# Altium project ACTUALFINALECU.PrjPcb (part 1 of 2)
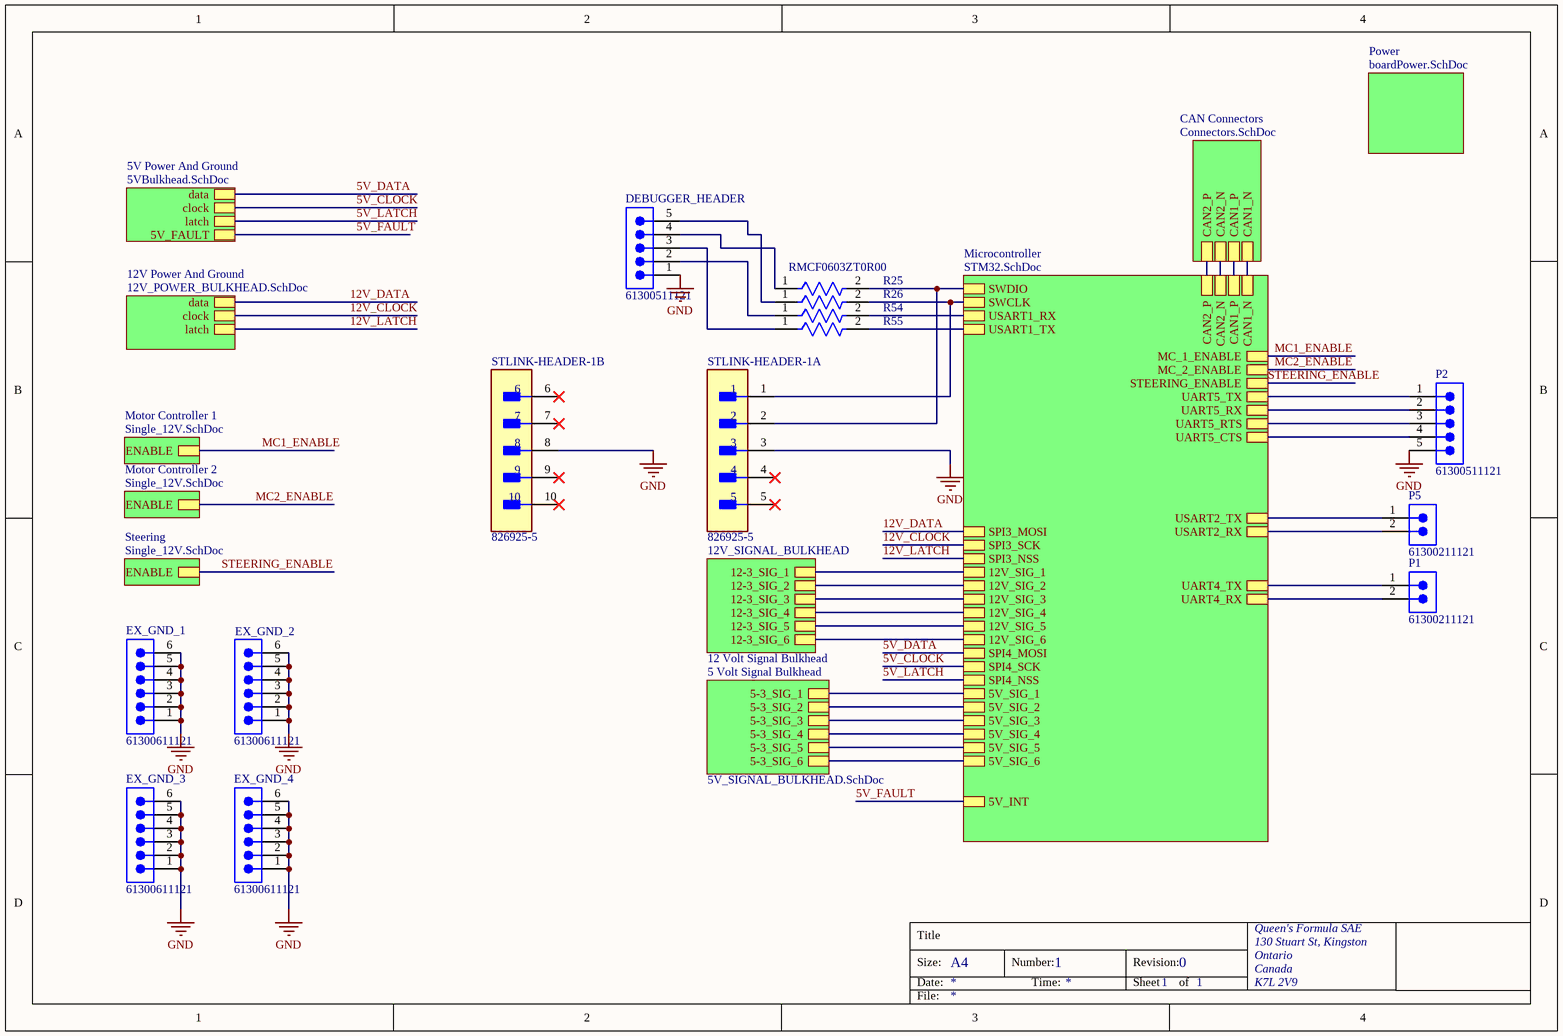
[diagram p0: TOP.SchDoc]
16 sheets, 240 parts. Net scope: hierarchical (ports join the sheet entries above them; power ports are global).
Board file: PCB.PcbDoc
Sheets:
  TOP.SchDoc
    Microcontroller = STM32.SchDoc
      CAN1 = CAN.SchDoc
      CAN2 = CAN.SchDoc
    12V Power And Ground = 12V_POWER_BULKHEAD.SchDoc
      Shift Register = shiftRegister.SchDoc
      Designator = 12V_LS.SchDoc
      Designator = 12V_LS.SchDoc
      Designator = 12V_LS.SchDoc
      Designator = 12V_LS.SchDoc
      Designator = 12V_LS.SchDoc
      Designator = 12V_LS.SchDoc
    Power = boardPower.SchDoc
      Buck = Buck.SchDoc
      LDO = LDO.SchDoc
    CAN Connectors = Connectors.SchDoc
    12 Volt Signal Bulkhead = 12V_SIGNAL_BULKHEAD.SchDoc
       = 12_TO_3V3_VOLTAGE_DIVIDER.SchDoc
       = 12_TO_3V3_VOLTAGE_DIVIDER.SchDoc
       = 12_TO_3V3_VOLTAGE_DIVIDER.SchDoc
       = 12_TO_3V3_VOLTAGE_DIVIDER.SchDoc
       = 12_TO_3V3_VOLTAGE_DIVIDER.SchDoc
       = 12_TO_3V3_VOLTAGE_DIVIDER.SchDoc
    5V Power And Ground = 5VBulkhead.SchDoc
      Shift Register = shiftRegister.SchDoc
      5VLS1 = 5V_LS.SchDoc
      5VLS2 = 5V_LS.SchDoc
      5VLS3 = 5V_LS.SchDoc
      5VLS4 = 5V_LS.SchDoc
      5VLS5 = 5V_LS.SchDoc
      5VLS6 = 5V_LS.SchDoc
    5 Volt Signal Bulkhead = 5V_SIGNAL_BULKHEAD.SchDoc
    Motor Controller 1 = Single_12V.SchDoc
      Designator = 12V_LS.SchDoc
    Motor Controller 2 = Single_12V.SchDoc
      Designator = 12V_LS.SchDoc
    Steering = Single_12V.SchDoc
      Designator = 12V_LS.SchDoc

## Sheet TOP.SchDoc: =DocumentName
size A4; Organization: Queen's Formula SAE; Address1: 130 Stuart St, Kingston; Address2: Ontario; Address3: Canada; Address4: K7L 2V9; DocumentNumber: 1; Revision: 0; SheetNumber: 1; SheetTotal: 1

### Parts
DEBUGGER_HEADER  61300511121  [61300511121]
EX_GND_1  61300611121  [61300611121]
EX_GND_2  61300611121  [61300611121]
EX_GND_3  61300611121  [61300611121]
EX_GND_4  61300611121  [61300611121]
P1  61300211121  [61300211121]
P2  61300511121  [61300511121]
P5  61300211121  [61300211121]
R25  RMCF0603ZT0R00  [FP-RMCF0603-MFG]
R26  RMCF0603ZT0R00  [FP-RMCF0603-MFG]  (value not drawn)
R54  RMCF0603ZT0R00  [FP-RMCF0603-MFG]  (value not drawn)
R55  RMCF0603ZT0R00  [FP-RMCF0603-MFG]  (value not drawn)
STLINK-HEADER-1  826925-5  [FP-826925-5-MFG]  (parts A,B of 2)

### Sub-sheets
5 Volt Signal Bulkhead = 5V_SIGNAL_BULKHEAD.SchDoc: 5-3_SIG_1, 5-3_SIG_2, 5-3_SIG_3, 5-3_SIG_4, 5-3_SIG_5, 5-3_SIG_6
5V Power And Ground = 5VBulkhead.SchDoc: data, clock, latch, 5V_FAULT
12 Volt Signal Bulkhead = 12V_SIGNAL_BULKHEAD: 12-3_SIG_1, 12-3_SIG_2, 12-3_SIG_3, 12-3_SIG_4, 12-3_SIG_5, 12-3_SIG_6
12V Power And Ground = 12V_POWER_BULKHEAD.SchDoc: data, clock, latch
CAN Connectors = Connectors.SchDoc: CAN1_N, CAN1_P, CAN2_N, CAN2_P
Microcontroller = STM32.SchDoc: SWDIO, SWCLK, USART1_RX, USART1_TX, SPI3_NSS, SPI3_MOSI, SPI3_SCK, CAN1_P, CAN1_N, CAN2_N, CAN2_P, 12V_SIG_1, MC_1_ENABLE, MC_2_ENABLE, STEERING_ENABLE, 12V_SIG_2, 12V_SIG_4, 12V_SIG_3, 12V_SIG_5, 12V_SIG_6, SPI4_NSS, SPI4_MOSI, SPI4_SCK, 5V_SIG_1, 5V_SIG_2, 5V_SIG_3, 5V_SIG_5, 5V_SIG_4, 5V_SIG_6, UART5_TX, UART5_RX, UART5_RTS, UART5_CTS, 5V_INT, USART2_TX, USART2_RX, UART4_TX, UART4_RX
Motor Controller 1 = Single_12V.SchDoc: ENABLE
Motor Controller 2 = Single_12V.SchDoc: ENABLE
Power = boardPower.SchDoc: no entries
Steering = Single_12V.SchDoc: ENABLE

### Nets
GND: DEBUGGER_HEADER.1 EX_GND_1.1 EX_GND_1.2 EX_GND_1.3 EX_GND_1.4 EX_GND_1.5 EX_GND_1.6 EX_GND_2.1 EX_GND_2.2 EX_GND_2.3 EX_GND_2.4 EX_GND_2.5 EX_GND_2.6 EX_GND_3.1 EX_GND_3.2 EX_GND_3.3 EX_GND_3.4 EX_GND_3.5 EX_GND_3.6 EX_GND_4.1 EX_GND_4.2 EX_GND_4.3 EX_GND_4.4 EX_GND_4.5 EX_GND_4.6 P2.5 STLINK-HEADER-1.3 STLINK-HEADER-1.8
5-3_1: sheet Microcontroller/5V_SIG_1, sheet 5 Volt Signal Bulkhead/5-3_SIG_1
5-3_2: sheet Microcontroller/5V_SIG_2, sheet 5 Volt Signal Bulkhead/5-3_SIG_2
5-3_3: sheet Microcontroller/5V_SIG_3, sheet 5 Volt Signal Bulkhead/5-3_SIG_3
5-3_4: sheet Microcontroller/5V_SIG_4, sheet 5 Volt Signal Bulkhead/5-3_SIG_4
5-3_5: sheet Microcontroller/5V_SIG_5, sheet 5 Volt Signal Bulkhead/5-3_SIG_5
5-3_6: sheet Microcontroller/5V_SIG_6, sheet 5 Volt Signal Bulkhead/5-3_SIG_6
5V_CLOCK: sheet Microcontroller/SPI4_SCK, sheet 5V Power And Ground/clock
5V_DATA: sheet Microcontroller/SPI4_MOSI, sheet 5V Power And Ground/data
5V_FAULT: sheet Microcontroller/5V_INT, sheet 5V Power And Ground/5V_FAULT
5V_LATCH: sheet Microcontroller/SPI4_NSS, sheet 5V Power And Ground/latch
12-3_1: sheet Microcontroller/12V_SIG_1, sheet 12 Volt Signal Bulkhead/12-3_SIG_1
12-3_2: sheet Microcontroller/12V_SIG_2, sheet 12 Volt Signal Bulkhead/12-3_SIG_2
12-3_3: sheet Microcontroller/12V_SIG_3, sheet 12 Volt Signal Bulkhead/12-3_SIG_3
12-3_4: sheet Microcontroller/12V_SIG_4, sheet 12 Volt Signal Bulkhead/12-3_SIG_4
12-3_5: sheet Microcontroller/12V_SIG_5, sheet 12 Volt Signal Bulkhead/12-3_SIG_5
12-3_6: sheet Microcontroller/12V_SIG_6, sheet 12 Volt Signal Bulkhead/12-3_SIG_6
12V_CLOCK: sheet Microcontroller/SPI3_SCK, sheet 12V Power And Ground/clock
12V_DATA: sheet Microcontroller/SPI3_MOSI, sheet 12V Power And Ground/data
12V_LATCH: sheet Microcontroller/SPI3_NSS, sheet 12V Power And Ground/latch
CAN1_N: sheet Microcontroller/CAN1_N, sheet CAN Connectors/CAN1_N
CAN1_P: sheet Microcontroller/CAN1_P, sheet CAN Connectors/CAN1_P
CAN2_N: sheet Microcontroller/CAN2_N, sheet CAN Connectors/CAN2_N
CAN2_P: sheet Microcontroller/CAN2_P, sheet CAN Connectors/CAN2_P
MC1_ENABLE: sheet Microcontroller/MC_1_ENABLE, sheet Motor Controller 1/ENABLE
MC2_ENABLE: sheet Microcontroller/MC_2_ENABLE, sheet Motor Controller 2/ENABLE
STEERING_ENABLE: sheet Microcontroller/STEERING_ENABLE, sheet Steering/ENABLE
NetDEBUGGER_HEADER_2: DEBUGGER_HEADER.2 R54.1
NetDEBUGGER_HEADER_3: DEBUGGER_HEADER.3 R55.1
NetDEBUGGER_HEADER_4: DEBUGGER_HEADER.4 R25.1
NetDEBUGGER_HEADER_5: DEBUGGER_HEADER.5 R26.1
NetP1_1: P1.1 ; sheet Microcontroller/UART4_TX
NetP1_2: P1.2 ; sheet Microcontroller/UART4_RX
NetP2_1: P2.1 ; sheet Microcontroller/UART5_TX
NetP2_2: P2.2 ; sheet Microcontroller/UART5_RX
NetP2_3: P2.3 ; sheet Microcontroller/UART5_RTS
NetP2_4: P2.4 ; sheet Microcontroller/UART5_CTS
NetP5_1: P5.1 ; sheet Microcontroller/USART2_TX
NetP5_2: P5.2 ; sheet Microcontroller/USART2_RX
NetR25_2: R25.2 STLINK-HEADER-1.2 ; sheet Microcontroller/SWDIO
NetR26_2: R26.2 STLINK-HEADER-1.1 ; sheet Microcontroller/SWCLK
NetR54_2: R54.2 ; sheet Microcontroller/USART1_RX
NetR55_2: R55.2 ; sheet Microcontroller/USART1_TX

Not connected (* = marked no-connect by the designer): STLINK-HEADER-1 4* 5* 6* 7* 9* 10*

### Notes on the sheet
- Title
- Size:
- Date:
- A4
- Number:
- Time:
- Revision:
- Sheet
- of
- File:

### Library data of the parts
DEBUGGER_HEADER P2 = CMP-1502-01068-2: NexarPartId: 32855526; Operating Supply Voltage: 250V; Number of Contacts: 5; Connector Type: Male Pin; Current Rating: 3A; Contact Resistance: 20mΩ; Pitch: 2.54mm; Gender: Male; Termination: Solder; RoHS: Compliant; Lead Pitch: 2.54mm; Contact Mating Length: 5.9944mm; Number of Positions: 5; Lead Free: Lead Free; Contact Plating: Gold; Number of Pins: 5; Min Operating Temperature: -40°C; Voltage Rating: 250V; Color: Black; Mount: Through Hole; REACH SVHC: Unknown; Packaging: Bulk; Height: 8.89mm; Number of Rows: 1; Orientation: Vertical; Contact Material: Copper; Max Operating Temperature: 105°C
EX_GND_1-EX_GND_4 = CMP-1502-01070-2: NexarPartId: 20084590; Operating Supply Voltage: 250V; Current Rating: 3A; Number of Contacts: 6; Gender: Male; Connector Type: Male Pin; Pitch: 2.54mm; Contact Resistance: 20mΩ; Lead Free: Lead Free; REACH SVHC: Unknown; Number of Rows: 1; Color: Black; Min Operating Temperature: -40°C; Contact Material: Copper; Lead Pitch: 2.54mm; Contact Plating: Gold; Number of Pins: 6; Height: 8.89mm; Orientation: Vertical; Termination: Through Hole; Mount: Through Hole; RoHS: Compliant; Contact Gender: Male; Contact Mating Length: 5.9944mm; Voltage Rating: 250V; Number of Positions: 6; Housing Material: PBT; Packaging: Bulk; Max Operating Temperature: 105°C
P1 P5 = CMP-1712-00002-5: NexarPartId: 20081794; Operating Supply Voltage: 250V; Current Rating: 3A; Gender: Male; Number of Contacts: 2; Pitch: 2.54mm; Connector Type: Male Pin; Contact Resistance: 20mΩ; Contact Plating: Gold; Contact Material: Copper; Number of Pins: 2; Min Operating Temperature: -40°C; Packaging: Bulk; Lead Pitch: 2.54mm; Mount: Through Hole; Orientation: Vertical; RoHS: Compliant; REACH SVHC: No SVHC; Height: 8.94mm; Termination: Through Hole; Number of Positions: 2; Contact Mating Length: 5.9944mm; Color: Black; Contact Gender: Male; Number of Rows: 1; Housing Material: PBT; Lead Free: Lead Free; Voltage Rating: 250V; Max Operating Temperature: 125°C
R25 R26 R54 R55 = CMP-26527-000011-1: RES 0 OHM JUMPER 1/10W 0603; Manufacturer: Stackpole; Power Rating: 0.1W; Voltage Rating: 75V; Resistance: 0mΩ; Automotive Grade: Grade 0; Value: 0mΩ; Series: RMCF; Manufacturer Part Number: RMCF0603ZT0R00; Device Class L1: Passive Components; Device Class L3: Chip SMD Resistors; Octopart: https://octopart.com/rmcf0603zt0r00-stackpole+electronics-19213618; Temperature: -55°C to +155°C; Lead Free: Yes; ComponentLink2URL: https://www.seielect.com/catalog/sei-rmcf_rmcp.pdf; Height: 0.55mm; Composition: Thick Film; Package: RMCF0603; Automotive: Yes; Temperature Range High: +155°C; Ipc Land Pattern Name: RESC15580X45; Digikey Description: RES 0 OHM JUMPER 1/10W 0603; RoHS: TRUE; ComponentLink2Description: Datasheet; Temperature Range Low: -55°C; Category: Res; Device Class L2: Resistors
STLINK-HEADER-1 = CMP-03369-000006-1: CONN HEADER VERT 10POS 2.54MM; Manufacturer: TE Connectivity; Conn Orientation: Vertical; Standoff Height: 0.3mm; Number Of Contacts: 10; Current Rating: 5A; Conn Gender: Male; Number Of Rows: 2; Category: Conn; Octopart: https://octopart.com/826925-5-te+connectivity-41836231; Lead Free: Yes; Height: 9.9mm; ComponentLink2Description: Datasheet; Temperature Range High: +105°C; Pitch: 2.54mm; Manufacturer Part Number: 826925-5; Automotive: No; Digikey Description: CONN HEADER VERT 10POS 2.54MM; ComponentLink2URL: https://www.te.com/commerce/DocumentDelivery/DDEController?Action=showdoc&DocId=Customer+Drawing%7F826629%7FAC%7Fpdf%7FEnglish%7FENG_CD_826629_AC.pdf%7F826925-5; Temperature: -65°C to +105°C; RoHS: TRUE; Package: 826925-5; Contact Material: Tin,Nickel; Mouser Description: Headers & Wire Housings 2X05 POS VERT TIN; Device Class L2: Headers and Wire Housings; Device Class L3: unset; Device Class L1: Connectors; Temperature Range Low: -65°C

## Sheet STM32.SchDoc
size A4
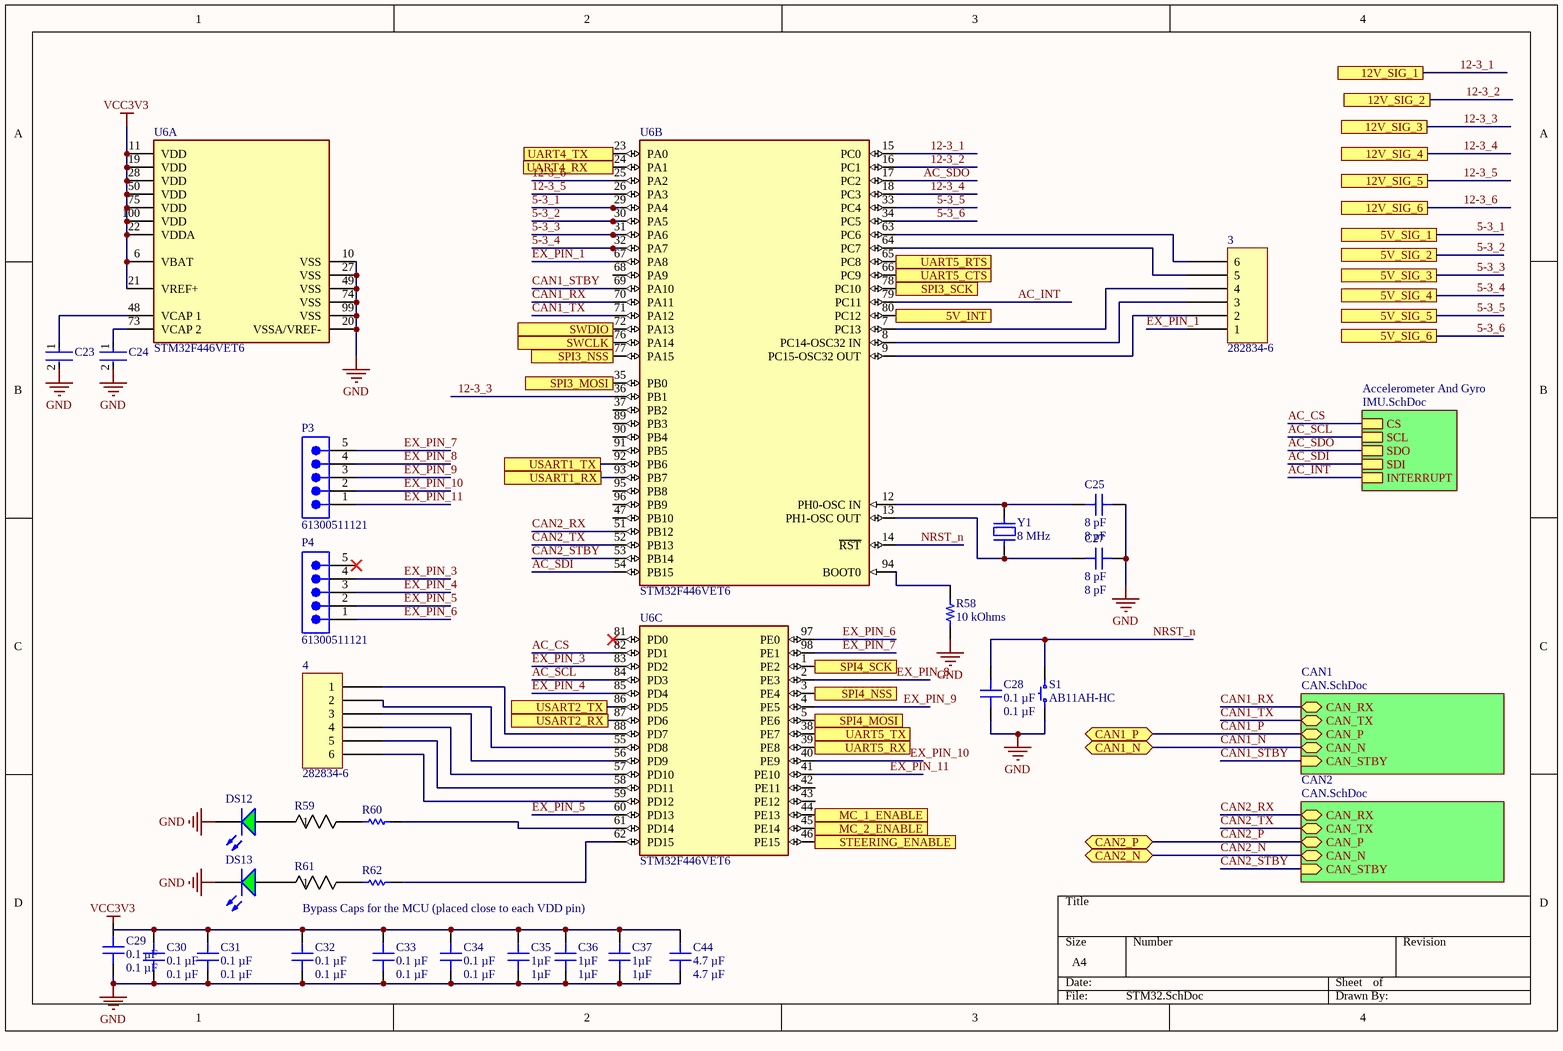
[diagram p1: STM32.SchDoc]

### Parts
3  282834-6  [TE 282834-6]
4  282834-6  [TE 282834-6]
C23  GRM188R71A225KE15D  [FP-GRM188-0_1-e0_2_0_5-MFG]  (value not drawn)
C24  GRM188R71A225KE15D  [FP-GRM188-0_1-e0_2_0_5-MFG]  (value not drawn)
C25  8 pF  [CAP 0805_2012]
C27  8 pF  [CAP 0805_2012]
C28  0.1 µF  [CAP 0805_2012]
C29  0.1 µF  [CAP 0805_2012]
C30  0.1 µF  [CAP 0805_2012]
C31  0.1 µF  [CAP 0805_2012]
C32  0.1 µF  [CAP 0805_2012]
C33  0.1 µF  [CAP 0805_2012]
C34  0.1 µF  [CAP 0805_2012]
C35  1µF  [CAP 0805_2012]
C36  1µF  [CAP 0805_2012]
C37  1µF  [CAP 0805_2012]
C44  4.7 µF  [CAP 0805_2012]
DS12  HLMP-4740  [AVAG-HLMP-4740]  (value not drawn)
DS13  HLMP-4740  [AVAG-HLMP-4740]  (value not drawn)
P3  61300511121  [61300511121]
P4  61300511121  [61300511121]
R58  10 kOhms  [RES 0805_2012]
R59  AC01000005000JA100  [RES_AC01_VIS]  (value not drawn)
R60  RC0805FR-071KL  [RESC2013X60X35ML10T20]  (value not drawn)
R61  AC01000005000JA100  [RES_AC01_VIS]  (value not drawn)
R62  RC0805FR-071KL  [RESC2013X60X35ML10T20]  (value not drawn)
S1  AB11AH-HC  [NKK AB11AH-HC]
U6  STM32F446VET6  [FP-LQFP100-1L-MFG]  (parts A,B,C of 3)
Y1  8 MHz  [ABRACON ABLS]

### Sub-sheets
Accelerometer And Gyro = IMU.SchDoc (file not in this document): CS, SCL, SDO, SDI, INTERRUPT
CAN1 = CAN.SchDoc: CAN_RX (bidir), CAN_TX (bidir), CAN_STBY (in), CAN_P (bidir), CAN_N (bidir)
CAN2 = CAN.SchDoc: CAN_RX (bidir), CAN_TX (bidir), CAN_STBY (in), CAN_P (bidir), CAN_N (bidir)

### Ports
5V_INT, 5V_SIG_1, 5V_SIG_2, 5V_SIG_3, 5V_SIG_4, 5V_SIG_5, 5V_SIG_6, 12V_SIG_1, 12V_SIG_2, 12V_SIG_3, 12V_SIG_4, 12V_SIG_5, 12V_SIG_6, CAN1_N (bidir), CAN1_P (bidir), CAN2_N (bidir), CAN2_P (bidir), MC_1_ENABLE, MC_2_ENABLE, SPI3_MOSI, SPI3_NSS, SPI3_SCK, SPI4_MOSI, SPI4_NSS, SPI4_SCK, STEERING_ENABLE, SWCLK, SWDIO, UART4_RX, UART4_TX, UART5_CTS, UART5_RTS, UART5_RX, UART5_TX, USART1_RX, USART1_TX, USART2_RX, USART2_TX

### Nets
GND: C23.2 C24.2 C25.2 C27.2 C28.1 C29.1 C30.1 C31.1 C32.1 C33.1 C34.1 C35.1 C36.1 C37.1 C44.1 DS12.2(K) DS13.2(K) R58.1 S1.1 U6.10(VSS) U6.20(VSSA/VREF-) U6.27(VSS) U6.49(VSS) U6.74(VSS) U6.99(VSS)
VCC3V3: C30.2 C31.2 C32.2 C33.2 C34.2 C35.2 C36.2 C37.2 C44.2 U6.6(VBAT) U6.11(VDD) U6.19(VDD) U6.21(VREF+) U6.22(VDDA) U6.28(VDD) U6.50(VDD) U6.75(VDD) U6.100(VDD)
5-3_1: U6.29(PA4) ; port 5V_SIG_1
5-3_2: U6.30(PA5) ; port 5V_SIG_2
5-3_3: U6.31(PA6) ; port 5V_SIG_3
5-3_4: U6.32(PA7) ; port 5V_SIG_4
5-3_5: U6.33(PC4) ; port 5V_SIG_5
5-3_6: U6.34(PC5) ; port 5V_SIG_6
5V_CLOCK: U6.1(PE2) ; port SPI4_SCK
5V_DATA: U6.5(PE6) ; port SPI4_MOSI
5V_FAULT: U6.80(PC12) ; port 5V_INT
5V_LATCH: U6.3(PE4) ; port SPI4_NSS
12-3_1: U6.15(PC0) ; port 12V_SIG_1
12-3_2: U6.16(PC1) ; port 12V_SIG_2
12-3_3: U6.36(PB1) ; port 12V_SIG_3
12-3_4: U6.18(PC3) ; port 12V_SIG_4
12-3_5: U6.26(PA3) ; port 12V_SIG_5
12-3_6: U6.25(PA2) ; port 12V_SIG_6
12V_CLOCK: U6.78(PC10) ; port SPI3_SCK
12V_DATA: U6.35(PB0) ; port SPI3_MOSI
12V_LATCH: U6.77(PA15) ; port SPI3_NSS
AC_CS: U6.82(PD1) ; sheet Accelerometer And Gyro/CS
AC_INT: U6.79(PC11) ; sheet Accelerometer And Gyro/INTERRUPT
AC_SCL: U6.84(PD3) ; sheet Accelerometer And Gyro/SCL
AC_SDI: U6.54(PB15) ; sheet Accelerometer And Gyro/SDI
AC_SDO: U6.17(PC2) ; sheet Accelerometer And Gyro/SDO
CAN1_N: port CAN1_N, sheet CAN1/CAN_N
CAN1_P: port CAN1_P, sheet CAN1/CAN_P
CAN1_RX: U6.70(PA11) ; sheet CAN1/CAN_RX
CAN1_STBY: U6.69(PA10) ; sheet CAN1/CAN_STBY
CAN1_TX: U6.71(PA12) ; sheet CAN1/CAN_TX
CAN2_N: port CAN2_N, sheet CAN2/CAN_N
CAN2_P: port CAN2_P, sheet CAN2/CAN_P
CAN2_RX: U6.51(PB12) ; sheet CAN2/CAN_RX
CAN2_STBY: U6.53(PB14) ; sheet CAN2/CAN_STBY
CAN2_TX: U6.52(PB13) ; sheet CAN2/CAN_TX
EX_PIN_1: 3.1 U6.67(PA8)
EX_PIN_3: P4.4 U6.83(PD2)
EX_PIN_4: P4.3 U6.85(PD4)
EX_PIN_5: P4.2 U6.60(PD13)
EX_PIN_6: P4.1 U6.97(PE0)
EX_PIN_7: P3.5 U6.98(PE1)
EX_PIN_8: P3.4 U6.2(PE3)
EX_PIN_9: P3.3 U6.4(PE5)
EX_PIN_10: P3.2 U6.40(PE9)
EX_PIN_11: P3.1 U6.41(PE10)
MC1_ENABLE: U6.44(PE13) ; port MC_1_ENABLE
MC2_ENABLE: U6.45(PE14) ; port MC_2_ENABLE
NRST_n: C28.2 S1.2 U6.14(~{RST})
STEERING_ENABLE: U6.46(PE15) ; port STEERING_ENABLE
Net3_2: 3.2 U6.9(PC15-OSC32_OUT)
Net3_3: 3.3 U6.8(PC14-OSC32_IN)
Net3_4: 3.4 U6.7(PC13)
Net3_5: 3.5 U6.64(PC7)
Net3_6: 3.6 U6.63(PC6)
Net4_1: 4.1 U6.88(PD7)
Net4_2: 4.2 U6.55(PD8)
Net4_3: 4.3 U6.56(PD9)
Net4_4: 4.4 U6.57(PD10)
Net4_5: 4.5 U6.58(PD11)
Net4_6: 4.6 U6.59(PD12)
NetC23_1: C23.1 U6.48(VCAP_1)
NetC24_1: C24.1 U6.73(VCAP_2)
NetC25_1: C25.1 U6.12(PH0-OSC_IN) Y1.2
NetC27_1: C27.1 U6.13(PH1-OSC_OUT) Y1.1
NetDS12_1: DS12.1(A) R59.1
NetDS13_1: DS13.1(A) R61.1
NetP1_1: U6.23(PA0) ; port UART4_TX
NetP1_2: U6.24(PA1) ; port UART4_RX
NetP2_1: U6.38(PE7) ; port UART5_TX
NetP2_2: U6.39(PE8) ; port UART5_RX
NetP2_3: U6.65(PC8) ; port UART5_RTS
NetP2_4: U6.66(PC9) ; port UART5_CTS
NetP5_1: U6.86(PD5) ; port USART2_TX
NetP5_2: U6.87(PD6) ; port USART2_RX
NetR25_2: U6.72(PA13) ; port SWDIO
NetR26_2: U6.76(PA14) ; port SWCLK
NetR54_2: U6.93(PB7) ; port USART1_RX
NetR55_2: U6.92(PB6) ; port USART1_TX
NetR58_2: R58.2 U6.94(BOOT0)
NetR59_2: R59.2 R60.1
NetR60_2: R60.2 U6.61(PD14)
NetR61_2: R61.2 R62.1
NetR62_2: R62.2 U6.62(PD15)

Not connected (* = marked no-connect by the designer): C29 2; P4 5*; U6 37(PB2) 42(PE11) 43(PE12) 47(PB10) 68(PA9) 81(PD0)* 89(PB3) 90(PB4) 91(PB5) 95(PB8) 96(PB9)

### Notes on the sheet
- Bypass Caps for the MCU (placed close to each VDD pin)

### Library data of the parts
3 4 = 282834-6: TERM BLK 6P SIDE ENT 2.54MM PCB; Manufacturer: TE Connectivity AMP Connectors; Current: 10A; Mating Orientation: Horizontal with Board; Number of Levels: 1; Pitch: 0.100" (2.54mm); Positions Per Level: 6; Voltage: 150V; Wire Gauge: 16-30 AWG; Wire Termination: Screw - Rising Cage Clamp; Part Number: 282834-6; Color: Green; ComponentLink1Description: Datasheet; ComponentLink1URL: https://www.te.com/commerce/DocumentDelivery/DDEController?Action=srchrtrv&DocNm=282834&DocType=Customer+Drawing&DocLang=English; ComponentLink2Description: DigiKey Link; ComponentLink2URL: http://digikey.com/product-detail/en/te-connectivity-amp-connectors/282834-6/A98337-ND/1153267; LastUpdated: 2020-01-15 4:16:31 AM; Lifecycle Status: Active; Minimum Order: 1; Mounting Type: Through Hole; Packaging: Bulk; Part Status: Active; Price: 4.72; Series: Buchanan; Supplier 1: DigiKey; Supplier Part Number 1: A98337-ND
C23 C24 = CMP-2006-02836-2: Chip Multilayer Ceramic Capacitors for General Purpose, 0603, 2.2uF, X7R, 15%, 10%, 10V; Case Code (Metric): 1608; Height: 0.8mm; Packaging: Cut Tape; Voltage: 10V; Lead Free: Lead Free; Min Operating Temperature: -55°C; Voltage Rating (DC): 10V; Max Operating Temperature: 125°C; Voltage Rating: 10V; Dielectric: X7R; Depth: 0.8mm; Case Code (Imperial): 0603; Termination: SMD/SMT; Case/Package: 0603; Number of Pins: 2; REACH SVHC: No SVHC; Mount: Surface Mount; Width: 0.031inch; Material: Ceramic; Capacitance: 2.2uF; Package Quantity: 1; Weight: 7.1E-05oz; Length: 1.6mm; Thickness: 0.035inch; Tolerance: 10%
C25 C27 = CBR08C809CAGAC: CAP CER 8PF 250V C0G/NP0 0805; Part Number: CBR08C809CAGAC; Value: 8 pF
C28-C34 = CC0805MRX7R9BB104: CAP CER 0.1UF 50V X7R 0805; Part Number: CC0805MRX7R9BB104; Value: 0.1 µF
C35-C37 = MM05ZC105KCZ2A: CAP CER 1UF 10V X7R 0805; Part Number: MM05ZC105KCZ2A; Value: 1µF
C44 = C0805X475J9RACAUTO: CAP CER 4.7UF 6.3V X7R 0805; Part Number: C0805X475J9RACAUTO; Value: 4.7 µF
DS12 DS13 = CMP-2000-06413-1: T-1 3/4 (5 mm) Low Current LED Lamp, Green, 1.9 V, -20 to 100 degC, 2-Pin THD, RoHS, Bulk; Manufacturer: AvagoTechnologies; Type: Uni-Color; Peak Wavelength: 565nm; Rad Hard: No; Viewing Angle: 50°; Dominant Wavelength/Color Temperature: 569nm; Number of LEDs: 1; Lens Appearance: ColoredDiffused; Lens Shape Type: Circular; Mounting Orientation: TopMount; Intensity: 2.3mcd; Datasheet Version: 07/2014; Category: LEDs; Datasheet URL: http://docs.avagotech.com/docs/AV02-1557EN; Packaging: Bulk; Pin Count: 2; Mounting Technology: ThroughHole; Package Reference: HLMP-4740; Mounting: ThroughHole; Manufacturer URL: http://www.avagotech.com/; Color: Green; Package: 2T-13/4; Package Description: 2-Pin Through Hole Device, Dia 5.845 mm, Pitch 2.54 mm
P3 P4 = CMP-1502-01068-2: as DEBUGGER_HEADER on sheet TOP; Termination: Solder; RoHS: Compliant; Lead Pitch: 2.54mm; Contact Mating Length: 5.9944mm; Number of Positions: 5; Lead Free: Lead Free; Contact Plating: Gold; Number of Pins: 5; Min Operating Temperature: -40°C; Voltage Rating: 250V; Color: Black; Mount: Through Hole; REACH SVHC: Unknown; Packaging: Bulk; Height: 8.89mm; Number of Rows: 1; Orientation: Vertical; Contact Material: Copper; Max Operating Temperature: 105°C
R58 = RNCS0805BKE10K0: RES 10K OHM 0.1% 1/10W 0805; Manufacturer: Stackpole Electronics Inc; Power (Watts): 0.1W, 1/10W; Temperature Coefficient: ±25ppm/°C; Part Number: RNCS0805BKE10K0; Value: 10 kOhms; ComponentLink1Description: Datasheet; ComponentLink1URL: https://www.seielect.com/catalog/sei-rncs_rnch.pdf; ComponentLink2Description: DigiKey Link; ComponentLink2URL: https://www.digikey.com/en/products/detail/stackpole-electronics-inc/RNCS0805BKE10K0/1800067; Composition: Thin Film; Device Package: 0805 (2012 Metric); Features: Anti-Corrosive, Automotive AEC-Q200, Moisture Resistant; Height - Seated (Max): 0.026" (0.65mm); LastUpdated: 2023-10-12 7:56:55 PM; Lifecycle Status: Active; Minimum Order: 1; Number of Terminations: 2; Operating Temperature: -55°C ~ 155°C; Package / Case: 0805 (2012 Metric); Packaging: TapeAndReel; PartId: 27713; Part Status: Active; Price: 0.07; Ratings: AEC-Q200; Resistance: 10 kOhms; Series: RNCS; Size / Dimension: 0.079" L x 0.049" W (2.00mm x 1.25mm); Supplier 1: DigiKey; Supplier Part Number 1: RNCS0805BKE10K0CT-ND; Supplier Device Package: 0805; Tolerance: ±0.1%
R59 R61 = CMP-00030-39746512-1: AC01000005000JA100 Res Wirewound 500 Ohm 5% 1W 100ppm/°C to 180ppm/°C Conformal AXL Thru-Hole Ammo Pack; Voltage Rating (DC): 22V; Lead Diameter: 800µm; Resistance: 500Ω; Weight: 519.986953mg; Number of Pins: 2; Min Operating Temperature: -40°C; Case/Package: Axial; Schedule B: 8533210080, 8533210080; Features: Flame Retardant Coating; Power Rating: 1W; Max Power Dissipation: 1W; Packaging: Tape & Box (TB); RoHS: Compliant; REACH SVHC: Unknown; NexarPartId: 39746512; Temperature Coefficient: 180ppm/°C; Diameter: 4.3mm; Contact Plating: Tin; Radiation Hardening: No; Max Operating Temperature: 275°C; Length: 11mm; Tolerance: 5%; Composition: Wirewound; Number of Terminations: 2; Termination: Axial; Voltage Rating: 22V
R60 R62 = CMP-2100-03671-1: Chip Resistor, 1 KOhm, +/- 1%, 125 mW, -55 to 155 degC, 0805 (2012 Metric), RoHS, Tape and Reel; Manufacturer: Yageo; Temperature Coefficient: 100ppm/degreesC; Voltage Rating (DC): 150V; Max Power Dissipation: 125mW; Resistance: 1KOhm; Number of Pins: 2; Number of Terminations: 2; Datasheet URL: http://www.yageo.com/NewPortal/yageodocoutput?fileName=/pdf/R-Chip/PYu-RC_Group_51_RoHS_L_5.pdf; Length: 0.079inch; Package Description: 2-Pin Surface Mounted Device, Body 2 x 1.25 mm; Depth: 1.25mm; Height: 0.024inch; Military Standard: Not; Case/Package: 0805; Package Reference: 0805; RoHSCompliant: true; Lead Free: LeadFree; Packaging: TapeandReel; Package Quantity: 1; Datasheet Version: Rev. 5, 10/2016; Tolerance: 1%; Min Operating Temperature: -55degC; Voltage Rating: 150V; Composition: ThickFilm; Case Code (Imperial): 0805; Power Rating: 125mW; Width: 0.049inch; Case Code (Metric): 2012; Manufacturer URL: http://www.yageo.com/; Max Operating Temperature: 155degC; REACH SVHC: Unknown; Termination: SMD/SMT
S1 = AB11AH-HC: SWITCH PUSH SPST-NO 0.4VA 28V; Manufacturer: NKK Switches; Actuator Type: Round, Button; Color - Actuator/Cap: Red; Current Rating (Amps): 0.4VA (AC/DC); Switch Function: Off-Mom; Part Number: AB11AH-HC; Circuit: SPST-NO; ComponentLink1Description: Datasheet; ComponentLink1URL: https://www.nkkswitches.com/pdf/Apushbuttons.pdf; ComponentLink2Description: DigiKey Link; ComponentLink2URL: http://digikey.com/product-detail/en/nkk-switches/AB11AH-HC/360-2604-ND/1056046; Features: Sealed - Fully; LastUpdated: 2020-01-25 8:05:42 PM; Lifecycle Status: Active; Minimum Order: 1; Mounting Type: Through Hole, Right Angle; Operating Temperature: -30°C ~ 85°C; Packaging: Tray; Part Status: Active; Price: 5.00; Series: AB; Supplier 1: DigiKey; Supplier Part Number 1: 360-2604-ND; Termination Style: PC Pin; Type: Standard; Voltage Rating - AC: 28V; Voltage Rating - DC: 28V
U6 = CMP-12105-000075-1: IC MCU 32BIT 512KB FLASH 100LQFP; Manufacturer: STMicroelectronics; Ram Size: 128KBytes; Data Bus Width: 32bits; Max Junction Temp: +125°C; Number Of Adc Channels: 16; Max Supply Voltage: 3.6V; Nominal Supply Current: 1.4-86mA; Number Of Uart Channels: 6; Core Architecture: ARM Cortex-M4; Standoff Height: 0.05mm; Number Of A/D Converters: 3; Frequency: 180MHz; Number Of Cores: 1; Min Supply Voltage: 1.65V; Number Of Timers/Counters: 14; Number Of Usb Channels: 2; Number Of Spi Channels: 4; Interface: I2C,SPI,UART,USART,Parallel,CAN,USB,LIN,IrDA,I2S,Other; Memory Size: 512KBytes; Number Of I/Os: 81; Ambient Temperature Range High: +85°C; Mouser Description: ARM Microcontrollers - MCU High-performance and DSP with FPU, ARM Cortex-M4 MCU with 512 Kbytes Flash, 180 MHz CPU, Art Accelerator, SDRAM; Device Class L2: Embedded Processors and Controllers; Temperature Range Low: -40°C; Device Class L1: Integrated Circuits (ICs); RoHS: TRUE; Ipc Land Pattern Name: QFP50P1600X1600X160-100; Manufacturer Part Number: STM32F446VET6; Octopart: https://octopart.com/stm32f446vet6-stmicroelectronics-52642922; Package: LQFP100-1L; Automotive: No; Category: IC; ComponentLink2URL: https://www.st.com/resource/en/datasheet/stm32f446ve.pdf; Digikey Description: IC MCU 32BIT 512KB FLASH 100LQFP; Temperature Range High: +85°C; Memory Type: FLASH; Lead Free: Yes; Height: 1.6mm; ComponentLink2Description: Datasheet; Number Of I2C Channels: 4; Device Class L3: Microcontrollers; Temperature: -40°C to +85°C; Ambient Temperature Range Low: -40°C
Y1 = ABLS-8.000MHZ-SD7Y-T: CRYSTAL 8.0000MHZ 18PF SMD; Manufacturer: Abracon LLC; ESR (Equivalent Series Resistance): 80 Ohms; Frequency Stability: ±30ppm; Frequency Tolerance: ±15ppm; Operating Mode: Fundamental; Part Number: ABLS-8.000MHZ-SD7Y-T; ComponentLink1Description: Datasheet; ComponentLink1URL: https://abracon.com/Resonators/abls.pdf; ComponentLink2Description: DigiKey Link; ComponentLink2URL: https://www.digikey.com/en/products/detail/abracon-llc/ABLS-8-000MHZ-SD7Y-T/8581989; Frequency: 8 MHz; Height - Seated (Max): 0.165" (4.20mm); LastUpdated: 2023-10-12 8:28:08 PM; Lifecycle Status: Active; Load Capacitance: 18pF; Minimum Order: 1; Mounting Type: Surface Mount; Operating Temperature: -40°C ~ 85°C; Package / Case: HC-49/US; Packaging: CutTape; PartId: 25; Part Status: Active; Price: 0.27; Series: ABLS; Size / Dimension: 0.449" L x 0.185" W (11.40mm x 4.70mm); Supplier 1: DigiKey; Supplier Part Number 1: 535-14365-2-ND; Type: MHz Crystal; Value: 8 MHz

## Sheet CAN.SchDoc
size A4
Used 2 times, as channels Microcontroller/CAN1, Microcontroller/CAN2. Parts and nets are listed once, with the designators drawn on the sheet.
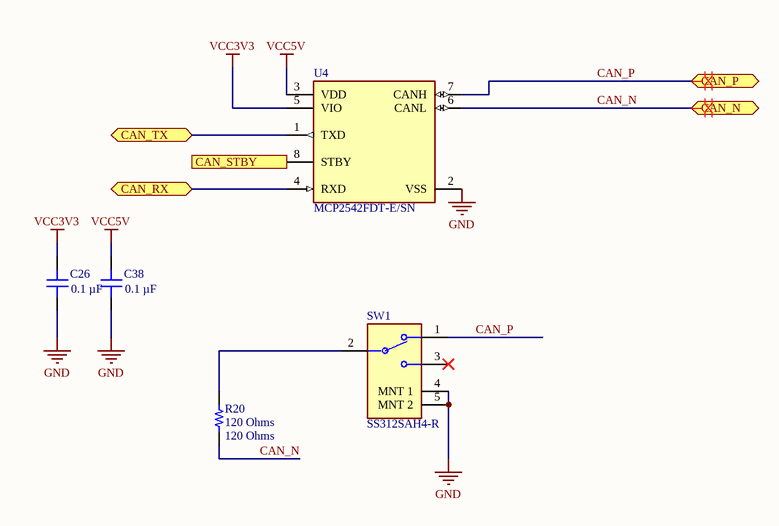
[diagram p2: CAN.SchDoc]

### Parts
C26  0.1 µF  [CAP 0805_2012]
C38  0.1 µF  [CAP 0805_2012]
R20  120 Ohms  [RES 0805_2012]
SW1  SS312SAH4-R  [FP-SS312SAH4-R-MFG]
U4  MCP2542FDT-E/SN  [FP-C04-057-SN-IPC_C]

### Ports
CAN_N (bidir), CAN_P (bidir), CAN_RX (bidir), CAN_STBY (in), CAN_TX (bidir)

### Nets
GND: C26.1 C38.1 SW1.4(MNT_1) SW1.5(MNT_2) U4.2(VSS)
VCC3V3: C26.2 U4.5(VIO)
VCC5V: C38.2 U4.3(VDD)
CAN_N: R20.1 U4.6(CANL) ; port CAN_N
CAN_P: SW1.1 U4.7(CANH) ; port CAN_P
CAN_RX: U4.4(RXD) ; port CAN_RX
CAN_STBY: U4.8(STBY) ; port CAN_STBY
CAN_TX: U4.1(TXD) ; port CAN_TX
NetR20_2: R20.2 SW1.2(COM)

Not connected (* = marked no-connect by the designer): SW1 3*

### Channels
Microcontroller/CAN1: designators end in _CAN1; ports CAN_N=CAN1_N CAN_P=CAN1_P CAN_RX=CAN1_RX CAN_STBY=CAN1_STBY CAN_TX=CAN1_TX
Microcontroller/CAN2: designators end in _CAN2; ports CAN_N=CAN2_N CAN_P=CAN2_P CAN_RX=CAN2_RX CAN_STBY=CAN2_STBY CAN_TX=CAN2_TX

### Layout directives
differential pair: CAN1_N, CAN1_P

### Library data of the parts
C26 C38 = CC0805MRX7R9BB104: CAP CER 0.1UF 50V X7R 0805; manufacturer: Yageo; Tolerance: ±20%; Part Number: CC0805MRX7R9BB104; Value: 0.1 µF; Applications: General Purpose; Capacitance: 0.1 µF; componentlink1description: Datasheet; componentlink1url: https://www.yageo.com/upload/media/product/productsearch/datasheet/mlcc/UPY-GPHC_X7R_6.3V-to-50V_18.pdf; componentlink2description: DigiKey Link; componentlink2url: https://www.digikey.com/en/products/detail/yageo/CC0805MRX7R9BB104/5884281; Device Package: 0805 (2012 Metric); lastupdated: 2023-10-12 7:14:35 PM; Lifecycle Status: Active; Minimum Order: 1; Mounting Type: Surface Mount, MLCC; Operating Temperature: -55°C ~ 125°C; Package / Case: 0805 (2012 Metric); packaging: TapeAndReel; partid: 2475; Part Status: Active; price: 0.01; series: CC; Size / Dimension: 0.079" L x 0.049" W (2.00mm x 1.25mm); Supplier 1: DigiKey; Supplier Part Number 1: 311-4351-1-ND; Temperature Coefficient: X7R; Thickness (Max): 0.037" (0.95mm); Voltage - Rated: 50V
R20 = ERJ-6ENF1200V: RES SMD 120 OHM 1% 1/8W 0805; Part Number: ERJ-6ENF1200V; Value: 120 Ohms
SW1 = CMP-31746-000001-1: SWITCH SLIDE SPDT 0.4VA 28V; Mechanical Life: 10000Cycles; Switch Function: On-On; Actuator Length: 2mm; Contact Style: Shorting; Max Current Rating: 100mA; Actuator Type: Standard; Actuator Material: Polyphenylene; Length: 10.5mm; Orientation: Right Angle; Voltage Rating (DC): 28V; Contact Material: Bronze; Electrical Life: 10000Cycles; Max Operating Temperature: 85°C; Case/Package: SMD/SMT; Depth: 7.45mm; Contact Plating: Gold; Voltage Rating (AC): 28V; Package Quantity: 1; Min Operating Temperature: -25°C; Switch Travel: 2mm; Housing Material: Bronze; RoHS Compliant: Yes; Lead Free: Lead Free; Termination: Gull Wing; Packaging: Tape and Reel; REACH SVHC: No SVHC; Mount: Surface Mount; Series: SS3; Throw Configuration: SPDT; Max Voltage Rating (AC): 28V; Max Voltage Rating (DC): 28V
U4 = CMP-06279-000006-1: IC TRANSCEIVER 1/1 8SOIC; Data Rate: 8Mbps; Receiver Hysteresis: 200mV; Min Operating Temperature: -40°C; Mount: Surface Mount; Case/Package: SOIC; Max Operating Temperature: 125°C; Packaging: Rail/Tube

## Sheet 12V_POWER_BULKHEAD.SchDoc
size A4
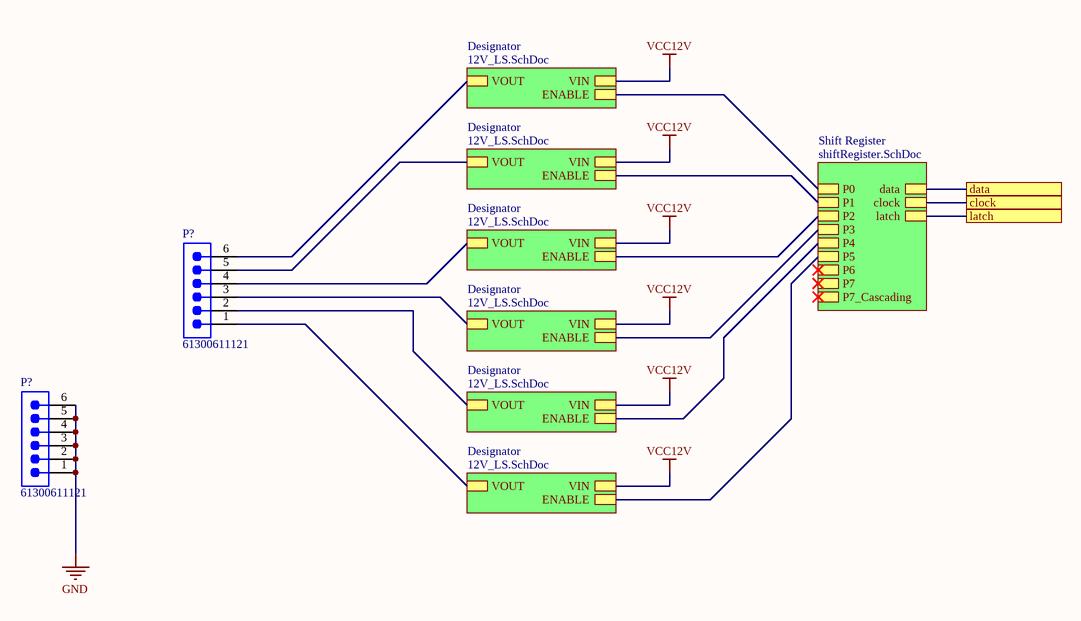
[diagram p3: 12V_POWER_BULKHEAD.SchDoc]

### Parts
(Parts that share a designator on the sheet are numbered #1, #2 ... from top to bottom, then left to right.)
P?#1  61300611121  [61300611121]
P?#2  61300611121  [61300611121]

### Sub-sheets
Designator = 12V_LS.SchDoc: VOUT, ENABLE, VIN
Designator = 12V_LS.SchDoc: VOUT, ENABLE, VIN
Designator = 12V_LS.SchDoc: VOUT, ENABLE, VIN
Designator = 12V_LS.SchDoc: VOUT, ENABLE, VIN
Designator = 12V_LS.SchDoc: VOUT, ENABLE, VIN
Designator = 12V_LS.SchDoc: VOUT, ENABLE, VIN
Shift Register = shiftRegister.SchDoc: P0, P1, P2, P3, P4, P5, P6, P7, P7_Cascading, data, clock, latch

### Ports
clock, data, latch

### Nets
GND: P?#2.1 P?#2.2 P?#2.3 P?#2.4 P?#2.5 P?#2.6
VCC12V: sheet Designator/VIN, sheet Designator/VIN, sheet Designator/VIN, sheet Designator/VIN, sheet Designator/VIN, sheet Designator/VIN
12V_CLOCK: port clock, sheet Shift Register/clock
12V_DATA: port data, sheet Shift Register/data
12V_LATCH: port latch, sheet Shift Register/latch
NetC5_12V_Power_And_Ground_Designator#1_2: P?#1.6 ; sheet Designator/VOUT
NetC5_12V_Power_And_Ground_Designator#2_2: P?#1.5 ; sheet Designator/VOUT
NetC5_12V_Power_And_Ground_Designator#3_2: P?#1.4 ; sheet Designator/VOUT
NetC5_12V_Power_And_Ground_Designator#4_2: P?#1.3 ; sheet Designator/VOUT
NetC5_12V_Power_And_Ground_Designator#5_2: P?#1.2 ; sheet Designator/VOUT
NetC5_12V_Power_And_Ground_Designator#6_2: P?#1.1 ; sheet Designator/VOUT
NetU1_12V_Power_And_Ground_Designator#1_2: sheet Shift Register/P0, sheet Designator/ENABLE
NetU1_12V_Power_And_Ground_Designator#2_2: sheet Shift Register/P1, sheet Designator/ENABLE
NetU1_12V_Power_And_Ground_Designator#3_2: sheet Shift Register/P2, sheet Designator/ENABLE
NetU1_12V_Power_And_Ground_Designator#4_2: sheet Shift Register/P3, sheet Designator/ENABLE
NetU1_12V_Power_And_Ground_Designator#5_2: sheet Shift Register/P4, sheet Designator/ENABLE
NetU1_12V_Power_And_Ground_Designator#6_2: sheet Shift Register/P5, sheet Designator/ENABLE

### Library data of the parts
P?#1 P?#2 = CMP-1502-01070-2: as EX_GND_1 on sheet TOP; Lead Free: Lead Free; REACH SVHC: Unknown; Number of Rows: 1; Color: Black; Min Operating Temperature: -40°C; Contact Material: Copper; Lead Pitch: 2.54mm; Contact Plating: Gold; Number of Pins: 6; Height: 8.89mm; Orientation: Vertical; Termination: Through Hole; Mount: Through Hole; RoHS: Compliant; Contact Gender: Male; Contact Mating Length: 5.9944mm; Voltage Rating: 250V; Number of Positions: 6; Housing Material: PBT; Packaging: Bulk; Max Operating Temperature: 105°C

## Sheet shiftRegister.SchDoc
size A4
Used 2 times, as channels 12V Power And Ground/Shift Register, 5V Power And Ground/Shift Register. Parts and nets are listed once, with the designators drawn on the sheet.
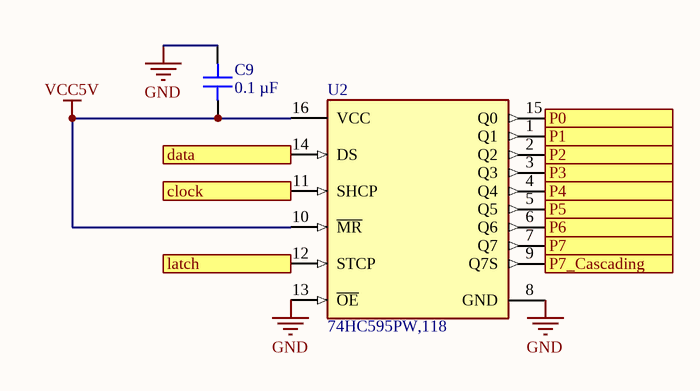
[diagram p4: shiftRegister.SchDoc]

### Parts
C9  0.1 µF  [CAP 0603_1608]
U2  74HC595PW,118  [FP-SOT403-1-MFG]

### Ports
clock, data, latch, P0, P1, P2, P3, P4, P5, P6, P7, P7_Cascading

### Nets
GND: C9.2 U2.8(GND) U2.13(~{OE})
VCC5V: C9.1 U2.10(~{MR}) U2.16(VCC)
clock: U2.11(SHCP) ; port clock
data: U2.14(DS) ; port data
latch: U2.12(STCP) ; port latch
P0: U2.15(Q0) ; port P0
P1: U2.1(Q1) ; port P1
P2: U2.2(Q2) ; port P2
P3: U2.3(Q3) ; port P3
P4: U2.4(Q4) ; port P4
P5: U2.5(Q5) ; port P5
P6: U2.6(Q6) ; port P6
P7: U2.7(Q7) ; port P7
P7_Cascading: U2.9(Q7S) ; port P7_Cascading

### Channels
12V Power And Ground/Shift Register: designators end in _12V_Power_And_Ground_Shift_Register; ports clock=12V_CLOCK data=12V_DATA latch=12V_LATCH P0=NetU1_12V_Power_And_Ground_Designator#1_2 P1=NetU1_12V_Power_And_Ground_Designator#2_2 P2=NetU1_12V_Power_And_Ground_Designator#3_2 P3=NetU1_12V_Power_And_Ground_Designator#4_2 P4=NetU1_12V_Power_And_Ground_Designator#5_2 P5=NetU1_12V_Power_And_Ground_Designator#6_2 P6=NetU2_12V_Power_And_Ground_Shift_Register_6 P7=NetU2_12V_Power_And_Ground_Shift_Register_7 P7_Cascading=NetU2_12V_Power_And_Ground_Shift_Register_9
5V Power And Ground/Shift Register: ports clock=5V_CLOCK data=5V_DATA latch=5V_LATCH P0=NetR12_5VLS1_1 P1=NetR12_5VLS2_1 P2=NetR12_5VLS3_1 P3=NetR12_5VLS4_1 P4=NetR12_5VLS5_1 P5=NetR12_5VLS6_1 P6=NetU2_6 P7=NetU2_7 P7_Cascading=NetU2_9

### Library data of the parts
C9 = C0603C104K5RAC7411: CAP CER 0.1UF 50V X7R 0603; manufacturer: KEMET; Tolerance: ±10%; Part Number: C0603C104K5RAC7411; Value: 0.1 µF; Applications: Bypass, Decoupling; Capacitance: 0.1 µF; componentlink1description: Datasheet; componentlink1url: https://api.kemet.com/component-edge/download/datasheet/C0603C104K5RAC7411.pdf; componentlink2description: DigiKey Link; componentlink2url: https://www.digikey.com/en/products/detail/kemet/C0603C104K5RAC7411/3317013; Device Package: 0603 (1608 Metric); lastupdated: 2023-06-20 7:12:54 PM; Lifecycle Status: Active; Minimum Order: 1; Mounting Type: Surface Mount, MLCC; Operating Temperature: -55°C ~ 125°C; Package / Case: 0603 (1608 Metric); packaging: TapeAndReel; partid: 2233; Part Status: Active; price: 0.01; series: SMD Comm X7R; Size / Dimension: 0.063" L x 0.031" W (1.60mm x 0.80mm); Supplier 1: DigiKey; Supplier Part Number 1: 399-C0603C104K5RAC7411CT-ND; Temperature Coefficient: X7R; Thickness (Max): 0.035" (0.90mm); Voltage - Rated: 50V
U2 = CMP-14351-000004-1: IC SHIFT REGISTER 8BIT 16TSSOP

## Sheet 12V_LS.SchDoc
size A4
Used 9 times, as channels 12V Power And Ground/Designator, 12V Power And Ground/Designator, 12V Power And Ground/Designator, 12V Power And Ground/Designator, 12V Power And Ground/Designator, 12V Power And Ground/Designator, Motor Controller 1/Designator, Motor Controller 2/Designator, Steering/Designator. Parts and nets are listed once, with the designators drawn on the sheet.
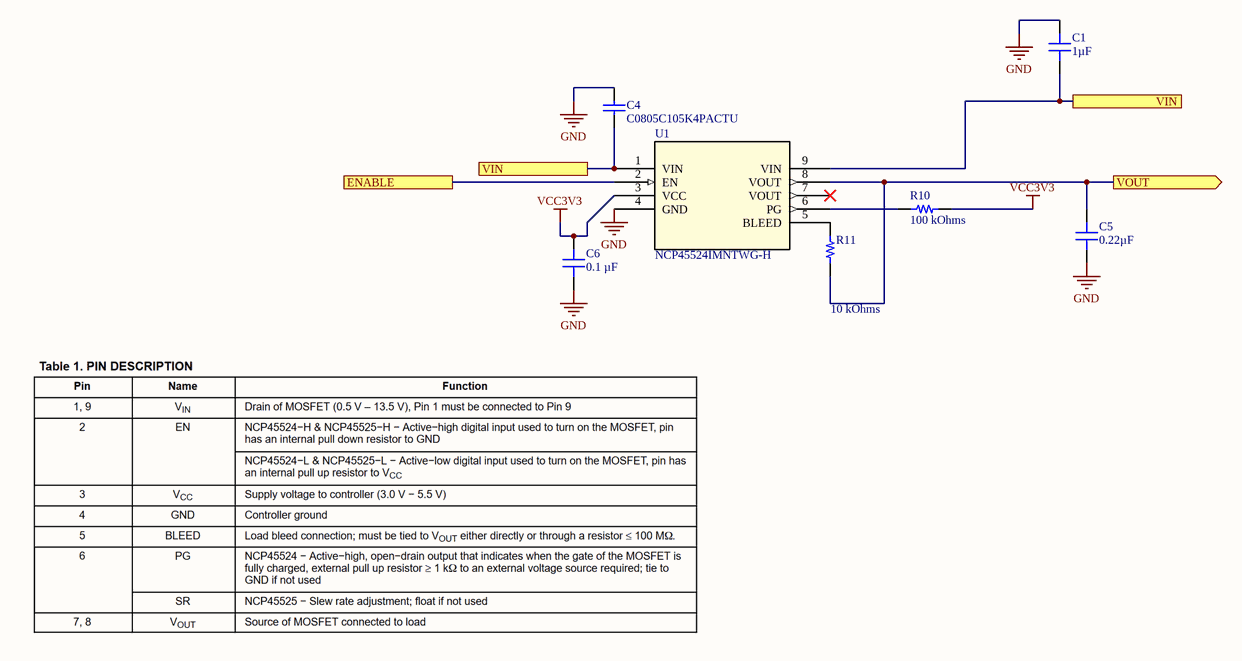
[diagram p5: 12V_LS.SchDoc]

### Parts
C1  1µF  [CAP 0805_2012]
C4  C0805C105K4PACTU  [CAPC2013X145X50LL20T25]
C5  0.22µF  [CAP 0805_2012]
C6  0.1 µF  [CAP 0805_2012]
R10  100 kOhms  [RES 0603_1608]
R11  10 kOhms  [RES 0603_1608]
U1  NCP45524IMNTWG-H  [SON50P200X200X100-9N]

### Ports
ENABLE, VIN, VOUT (out)

### Nets
GND: C1.2 C4.2 C5.1 C6.1 U1.4(GND)
VCC3V3: C6.2 R10.2 U1.3(VCC)
ENABLE: U1.2(EN) ; port ENABLE
VIN: C1.1 C4.1 U1.1(VIN) U1.9(VIN) ; port VIN
VOUT: C5.2 R11.1 U1.8(VOUT) ; port VOUT
NetR10_1: R10.1 U1.6(PG)
NetR11_2: R11.2 U1.5(BLEED)

Not connected (* = marked no-connect by the designer): U1 7(VOUT)*

### Channels
12V Power And Ground/Designator: designators end in _12V_Power_And_Ground_Designator#1; ports ENABLE=NetU1_12V_Power_And_Ground_Designator#1_2 VIN=VCC12V VOUT=NetC5_12V_Power_And_Ground_Designator#1_2
12V Power And Ground/Designator: designators end in _12V_Power_And_Ground_Designator#2; ports ENABLE=NetU1_12V_Power_And_Ground_Designator#2_2 VIN=VCC12V VOUT=NetC5_12V_Power_And_Ground_Designator#2_2
12V Power And Ground/Designator: designators end in _12V_Power_And_Ground_Designator#3; ports ENABLE=NetU1_12V_Power_And_Ground_Designator#3_2 VIN=VCC12V VOUT=NetC5_12V_Power_And_Ground_Designator#3_2
12V Power And Ground/Designator: designators end in _12V_Power_And_Ground_Designator#4; ports ENABLE=NetU1_12V_Power_And_Ground_Designator#4_2 VIN=VCC12V VOUT=NetC5_12V_Power_And_Ground_Designator#4_2
12V Power And Ground/Designator: designators end in _12V_Power_And_Ground_Designator#5; ports ENABLE=NetU1_12V_Power_And_Ground_Designator#5_2 VIN=VCC12V VOUT=NetC5_12V_Power_And_Ground_Designator#5_2
12V Power And Ground/Designator: designators end in _12V_Power_And_Ground_Designator#6; ports ENABLE=NetU1_12V_Power_And_Ground_Designator#6_2 VIN=VCC12V VOUT=NetC5_12V_Power_And_Ground_Designator#6_2
Motor Controller 1/Designator: designators C1=C1 C4=C4_Motor_Controller_1_Designator C5=C5_Motor_Controller_1_Designator C6=C6 R10=R10 R11=R11 U1=U1; ports ENABLE=MC1_ENABLE VIN=VCC12V VOUT=NetC5_Motor_Controller_1_Designator_2
Motor Controller 2/Designator: designators end in _Motor_Controller_2_Designator; ports ENABLE=MC2_ENABLE VIN=VCC12V VOUT=NetC5_Motor_Controller_2_Designator_2
Steering/Designator: designators end in _Steering_Designator; ports ENABLE=STEERING_ENABLE VIN=VCC12V VOUT=NetC5_Steering_Designator_2

### Library data of the parts
C1 = LGC26D105MAT2S1: CAP CER 1UF 6.3V X5R 0805; manufacturer: AVX Corporation; Tolerance: ±20%; Part Number: LGC26D105MAT2S1; Value: 1µF; Applications: Bypass, Decoupling; Capacitance: 1µF; componentlink1description: Datasheet; componentlink1url: http://datasheets.avx.com/LGA.pdf; componentlink2description: DigiKey Link; componentlink2url: http://digikey.com/product-detail/en/avx-corporation/LGC26D105MAT2S1/478-6694-1-ND/2694148; Device Package: 0805 (2012 Metric); Features: Low ESL (Multi-Terminal); lastupdated: 2020-09-02 1:04:42 AM; Lifecycle Status: Active; Minimum Order: 1; Mounting Type: Surface Mount, MLCC; Operating Temperature: -55°C ~ 85°C; Package / Case: 0805 (2012 Metric); packaging: TapeAndReel; partid: 2463; Part Status: Active; price: 0.63; series: LGC2 (LGA); Size / Dimension: 0.081" L x 0.052" W (2.06mm x 1.32mm); Supplier 1: DigiKey; Supplier Part Number 1: 478-6694-1-ND; Temperature Coefficient: X5R; Thickness (Max): 0.022" (0.55mm); Voltage - Rated: 6.3V
C4 = CMP-1036-04746-2: Manufacturer: Kemet; Part Number: C0805C105K4PACTU
C5 = MM055C224KCZ2A: CAP CER 0.22UF 50V X7R 0805; manufacturer: AVX Corporation; Tolerance: ±10%; Part Number: MM055C224KCZ2A; Value: 0.22µF; Applications: Medical, Non-Critical; Capacitance: 0.22µF; componentlink1description: Datasheet; componentlink1url: http://datasheets.avx.com/AVX-MM.pdf; componentlink2description: DigiKey Link; componentlink2url: http://digikey.com/product-detail/en/avx-corporation/MM055C224KCZ2A/478-10609-1-ND/7344870; Device Package: 0805 (2012 Metric); lastupdated: 2020-09-02 1:04:42 AM; Lifecycle Status: Active; Minimum Order: 1; Mounting Type: Surface Mount, MLCC; Operating Temperature: -55°C ~ 125°C; Package / Case: 0805 (2012 Metric); packaging: TapeAndReel; partid: 2435; Part Status: Active; price: 0.50; series: MM; Size / Dimension: 0.079" L x 0.049" W (2.01mm x 1.25mm); Supplier 1: DigiKey; Supplier Part Number 1: 478-10609-1-ND; Temperature Coefficient: X7R; Thickness (Max): 0.029" (0.74mm); Voltage - Rated: 50V
C6 = CC0805MRX7R9BB104: as C26 on sheet CAN; Part Number: CC0805MRX7R9BB104; Value: 0.1 µF; Applications: General Purpose; Capacitance: 0.1 µF; componentlink1description: Datasheet; componentlink1url: https://www.yageo.com/upload/media/product/productsearch/datasheet/mlcc/UPY-GPHC_X7R_6.3V-to-50V_18.pdf; componentlink2description: DigiKey Link; componentlink2url: https://www.digikey.com/en/products/detail/yageo/CC0805MRX7R9BB104/5884281; Device Package: 0805 (2012 Metric); lastupdated: 2023-10-02 7:13:07 PM; Lifecycle Status: Active; Minimum Order: 1; Mounting Type: Surface Mount, MLCC; Operating Temperature: -55°C ~ 125°C; Package / Case: 0805 (2012 Metric); packaging: TapeAndReel; partid: 2475; Part Status: Active; price: 0.01; series: CC; Size / Dimension: 0.079" L x 0.049" W (2.00mm x 1.25mm); Supplier 1: DigiKey; Supplier Part Number 1: 311-4351-1-ND; Temperature Coefficient: X7R; Thickness (Max): 0.037" (0.95mm); Voltage - Rated: 50V
R10 = RNCS0603BKE100K: RES 100K OHM 0.1% 1/16W 0603; Manufacturer: Stackpole Electronics Inc; Power (Watts): 0.063W, 1/16W; Temperature Coefficient: ±25ppm/°C; Part Number: RNCS0603BKE100K; Value: 100 kOhms; ComponentLink1Description: Datasheet; ComponentLink1URL: https://www.seielect.com/catalog/sei-rncs_rnch.pdf; ComponentLink2Description: DigiKey Link; ComponentLink2URL: https://www.digikey.com/en/products/detail/stackpole-electronics-inc/RNCS0603BKE100K/1708835; Composition: Thin Film; Device Package: 0603 (1608 Metric); Features: Anti-Corrosive, Automotive AEC-Q200, Moisture Resistant; Height - Seated (Max): 0.022" (0.55mm); LastUpdated: 2023-06-04 7:36:27 PM; Lifecycle Status: Active; Minimum Order: 1; Number of Terminations: 2; Operating Temperature: -55°C ~ 155°C; Package / Case: 0603 (1608 Metric); Packaging: TapeAndReel; PartId: 4849; Part Status: Active; Price: 0.07; Ratings: AEC-Q200; Resistance: 100 kOhms; Series: RNCS; Size / Dimension: 0.061" L x 0.031" W (1.55mm x 0.80mm); Supplier 1: DigiKey; Supplier Part Number 1: RNCS0603BKE100KCT-ND; Supplier Device Package: 0603; Tolerance: ±0.1%
R11 = RNCS0603BKE10K0: RES 10K OHM 0.1% 1/16W 0603; Manufacturer: Stackpole Electronics Inc; Power (Watts): 0.063W, 1/16W; Temperature Coefficient: ±25ppm/°C; Part Number: RNCS0603BKE10K0; Value: 10 kOhms; ComponentLink1Description: Datasheet; ComponentLink1URL: https://www.seielect.com/catalog/sei-rncs_rnch.pdf; ComponentLink2Description: DigiKey Link; ComponentLink2URL: https://www.digikey.com/en/products/detail/stackpole-electronics-inc/RNCS0603BKE10K0/1708836; Composition: Thin Film; Device Package: 0603 (1608 Metric); Features: Anti-Corrosive, Automotive AEC-Q200, Moisture Resistant; Height - Seated (Max): 0.022" (0.55mm); LastUpdated: 2023-06-04 7:36:27 PM; Lifecycle Status: Active; Minimum Order: 1; Number of Terminations: 2; Operating Temperature: -55°C ~ 155°C; Package / Case: 0603 (1608 Metric); Packaging: TapeAndReel; PartId: 4838; Part Status: Active; Price: 0.07; Ratings: AEC-Q200; Resistance: 10 kOhms; Series: RNCS; Size / Dimension: 0.061" L x 0.031" W (1.55mm x 0.80mm); Supplier 1: DigiKey; Supplier Part Number 1: RNCS0603BKE10K0CT-ND; Supplier Device Package: 0603; Tolerance: ±0.1%
U1 = NCP45524IMNTWG-H: No Description Available; Mfr_Name: onsemi; Copyright: Copyright (C) 2023 Ultra Librarian. All rights reserved.; Manufacturer_Part_Number: NCP45524IMNTWG-H; RefDes: RefDes; Type: DEV

## Sheet boardPower.SchDoc
size A4
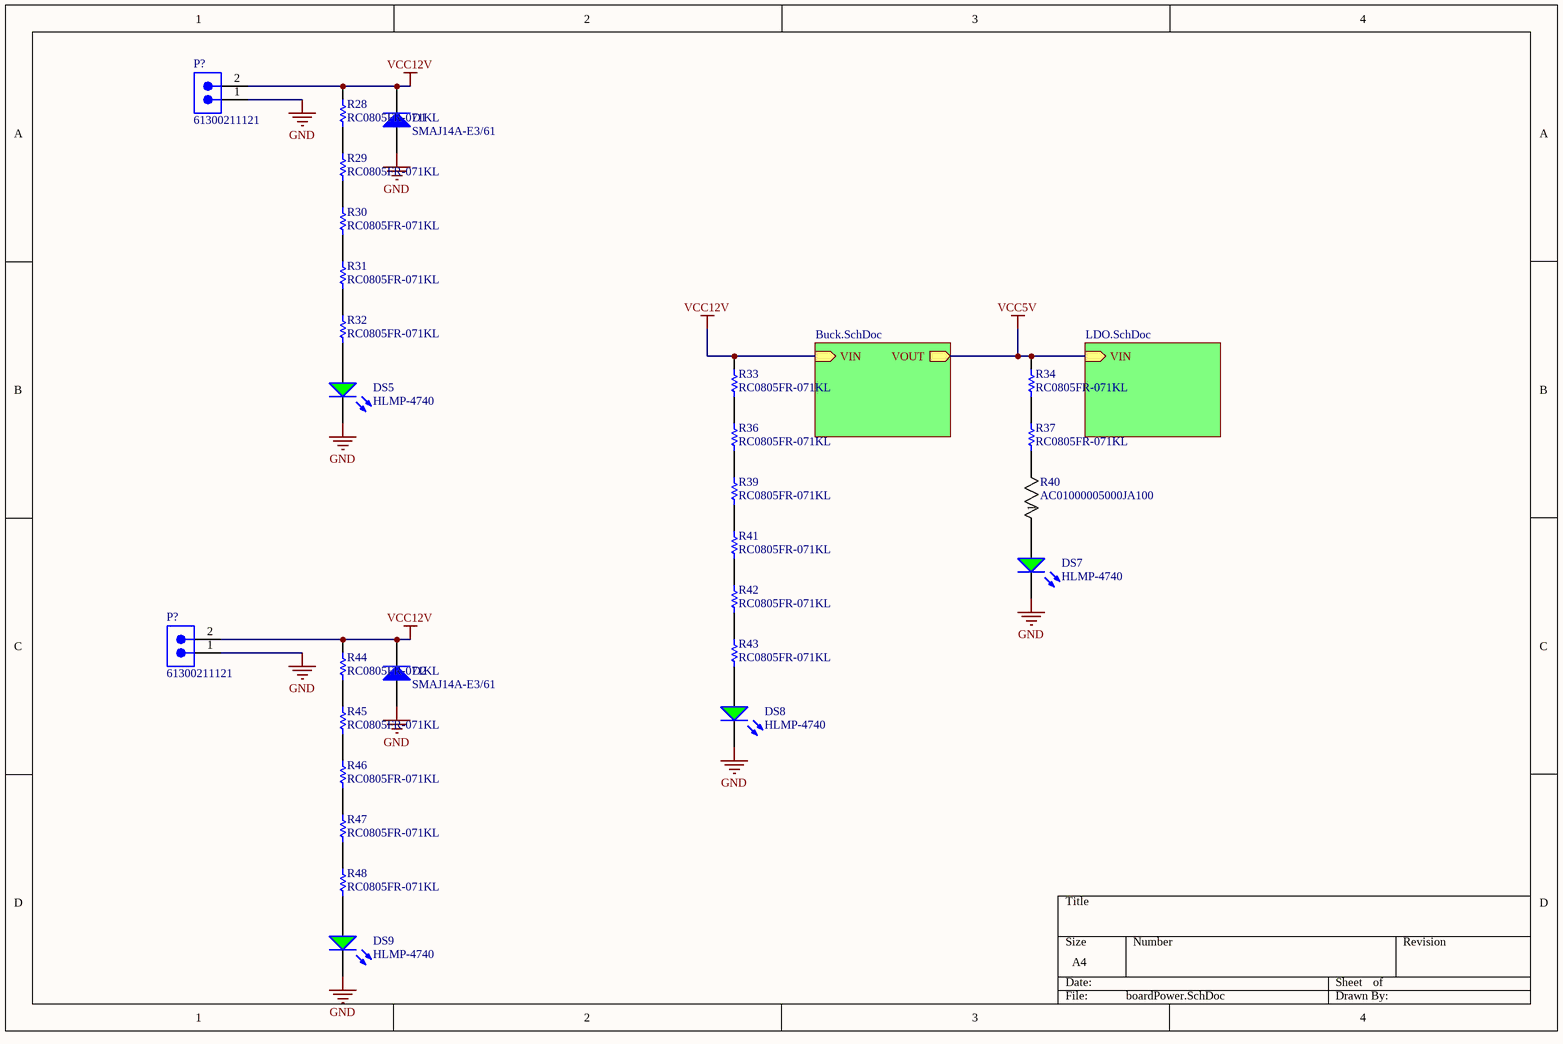
[diagram p6: boardPower.SchDoc]

### Parts
(Parts that share a designator on the sheet are numbered #1, #2 ... from top to bottom, then left to right.)
D1  SMAJ14A-E3/61  [VISH-DO-214AC-2_L]
D2  SMAJ14A-E3/61  [VISH-DO-214AC-2_L]
DS5  HLMP-4740  [AVAG-HLMP-4740]
DS7  HLMP-4740  [AVAG-HLMP-4740]
DS8  HLMP-4740  [AVAG-HLMP-4740]
DS9  HLMP-4740  [AVAG-HLMP-4740]
P?#3  61300211121  [61300211121]
P?#4  61300211121  [61300211121]
R28  RC0805FR-071KL  [RESC2013X60X35ML10T20]
R29  RC0805FR-071KL  [RESC2013X60X35ML10T20]
R30  RC0805FR-071KL  [RESC2013X60X35ML10T20]
R31  RC0805FR-071KL  [RESC2013X60X35ML10T20]
R32  RC0805FR-071KL  [RESC2013X60X35ML10T20]
R33  RC0805FR-071KL  [RESC2013X60X35ML10T20]
R34  RC0805FR-071KL  [RESC2013X60X35ML10T20]
R36  RC0805FR-071KL  [RESC2013X60X35ML10T20]
R37  RC0805FR-071KL  [RESC2013X60X35ML10T20]
R39  RC0805FR-071KL  [RESC2013X60X35ML10T20]
R40  AC01000005000JA100  [RES_AC01_VIS]
R41  RC0805FR-071KL  [RESC2013X60X35ML10T20]
R42  RC0805FR-071KL  [RESC2013X60X35ML10T20]
R43  RC0805FR-071KL  [RESC2013X60X35ML10T20]
R44  RC0805FR-071KL  [RESC2013X60X35ML10T20]
R45  RC0805FR-071KL  [RESC2013X60X35ML10T20]
R46  RC0805FR-071KL  [RESC2013X60X35ML10T20]
R47  RC0805FR-071KL  [RESC2013X60X35ML10T20]
R48  RC0805FR-071KL  [RESC2013X60X35ML10T20]

### Sub-sheets
Buck = Buck.SchDoc: VIN (in), VOUT (out)
LDO = LDO.SchDoc: VIN (in)

### Nets
GND: D1.2(A) D2.2(A) DS5.2(K) DS7.2(K) DS8.2(K) DS9.2(K) P?#3.1 P?#4.1
VCC5V: R34.2 ; sheet Buck/VOUT, sheet LDO/VIN
VCC12V: D1.1(K) D2.1(K) P?#3.2 P?#4.2 R28.2 R33.2 R44.2 ; sheet Buck/VIN
NetDS5_1: DS5.1(A) R32.1
NetDS7_1: DS7.1(A) R40.1
NetDS8_1: DS8.1(A) R43.1
NetDS9_1: DS9.1(A) R48.1
NetR28_1: R28.1 R29.2
NetR29_1: R29.1 R30.2
NetR30_1: R30.1 R31.2
NetR31_1: R31.1 R32.2
NetR33_1: R33.1 R36.2
NetR34_1: R34.1 R37.2
NetR36_1: R36.1 R39.2
NetR37_1: R37.1 R40.2
NetR39_1: R39.1 R41.2
NetR41_1: R41.1 R42.2
NetR42_1: R42.1 R43.2
NetR44_1: R44.1 R45.2
NetR45_1: R45.1 R46.2
NetR46_1: R46.1 R47.2
NetR47_1: R47.1 R48.2

### Library data of the parts
D1 D2 = CMP-0548-00224-2: Transient Voltage Suppressor, 6.40 to 231 V, 14 V Stand-off Voltage, Uni-Directional, -55 to 155 degC, 2-pin DO-214AC, Pb-Free, Tape and Reel; Manufacturer: Vishay Semiconductor; PPPM (W): 400, 300; VWM (V): 14; VBR Uni-Directional (V): 6.4 to 231; IFSM: 40 A; ID (uA): 1; PackageDescription: 2-Pin DO-214AC (SMA), Body 4.245 x 2.665 mm; ComponentLink2URL: http://www.vishay.com/docs/88390/smaj50a.pdf; Mounting Technology: Surface Mount; PartNumber: SMAJ14A-E3/61; Operating Junction and Storage Temperature Range: -55 to 150 degC; ComponentLink2Description: Datasheet; Packing: Tape and Reel; PackageReference: DO-214AC-2; ComponentLink3Description: Package Specification; ComponentLink1URL: http://www.vishay.com/; RoHS: TRUE; ComponentLink3URL: http://www.vishay.com/docs/88390/smaj50a.pdf; ComponentLink1Description: Manufacturer URL; DatasheetVersion: 12/8/2013
DS5 DS7-DS9 = CMP-2000-06413-1: as DS12 on sheet STM32; Datasheet Version: 07/2014; Category: LEDs; Datasheet URL: http://docs.avagotech.com/docs/AV02-1557EN; Packaging: Bulk; Pin Count: 2; Mounting Technology: ThroughHole; Package Reference: HLMP-4740; Mounting: ThroughHole; Manufacturer URL: http://www.avagotech.com/; Color: Green; Package: 2T-13/4; Package Description: 2-Pin Through Hole Device, Dia 5.845 mm, Pitch 2.54 mm
P?#3 P?#4 = CMP-1712-00002-5: as P1 on sheet TOP; Contact Plating: Gold; Contact Material: Copper; Number of Pins: 2; Min Operating Temperature: -40°C; Packaging: Bulk; Lead Pitch: 2.54mm; Mount: Through Hole; Orientation: Vertical; RoHS: Compliant; REACH SVHC: No SVHC; Height: 8.94mm; Termination: Through Hole; Number of Positions: 2; Contact Mating Length: 5.9944mm; Color: Black; Contact Gender: Male; Number of Rows: 1; Housing Material: PBT; Lead Free: Lead Free; Voltage Rating: 250V; Max Operating Temperature: 125°C
R28-R34 R36 R37 R39 R41-R48 = CMP-2100-03671-1: as R60 on sheet STM32; Number of Pins: 2; Number of Terminations: 2; Datasheet URL: http://www.yageo.com/NewPortal/yageodocoutput?fileName=/pdf/R-Chip/PYu-RC_Group_51_RoHS_L_5.pdf; Length: 0.079inch; Package Description: 2-Pin Surface Mounted Device, Body 2 x 1.25 mm; Depth: 1.25mm; Height: 0.024inch; Military Standard: Not; Case/Package: 0805; Package Reference: 0805; RoHSCompliant: true; Lead Free: LeadFree; Packaging: TapeandReel; Package Quantity: 1; Datasheet Version: Rev. 5, 10/2016; Tolerance: 1%; Min Operating Temperature: -55degC; Voltage Rating: 150V; Composition: ThickFilm; Case Code (Imperial): 0805; Power Rating: 125mW; Width: 0.049inch; Case Code (Metric): 2012; Manufacturer URL: http://www.yageo.com/; Max Operating Temperature: 155degC; REACH SVHC: Unknown; Termination: SMD/SMT
R40 = CMP-00030-39746512-1: as R59 on sheet STM32; Weight: 519.986953mg; Number of Pins: 2; Min Operating Temperature: -40°C; Case/Package: Axial; Schedule B: 8533210080, 8533210080; Features: Flame Retardant Coating; Power Rating: 1W; Max Power Dissipation: 1W; Packaging: Tape & Box (TB); RoHS: Compliant; REACH SVHC: Unknown; NexarPartId: 39746512; Temperature Coefficient: 180ppm/°C; Diameter: 4.3mm; Contact Plating: Tin; Radiation Hardening: No; Max Operating Temperature: 275°C; Length: 11mm; Tolerance: 5%; Composition: Wirewound; Number of Terminations: 2; Termination: Axial; Voltage Rating: 22V